# EAGLE design InCTF_Badge (EAGLE 9.4.2)
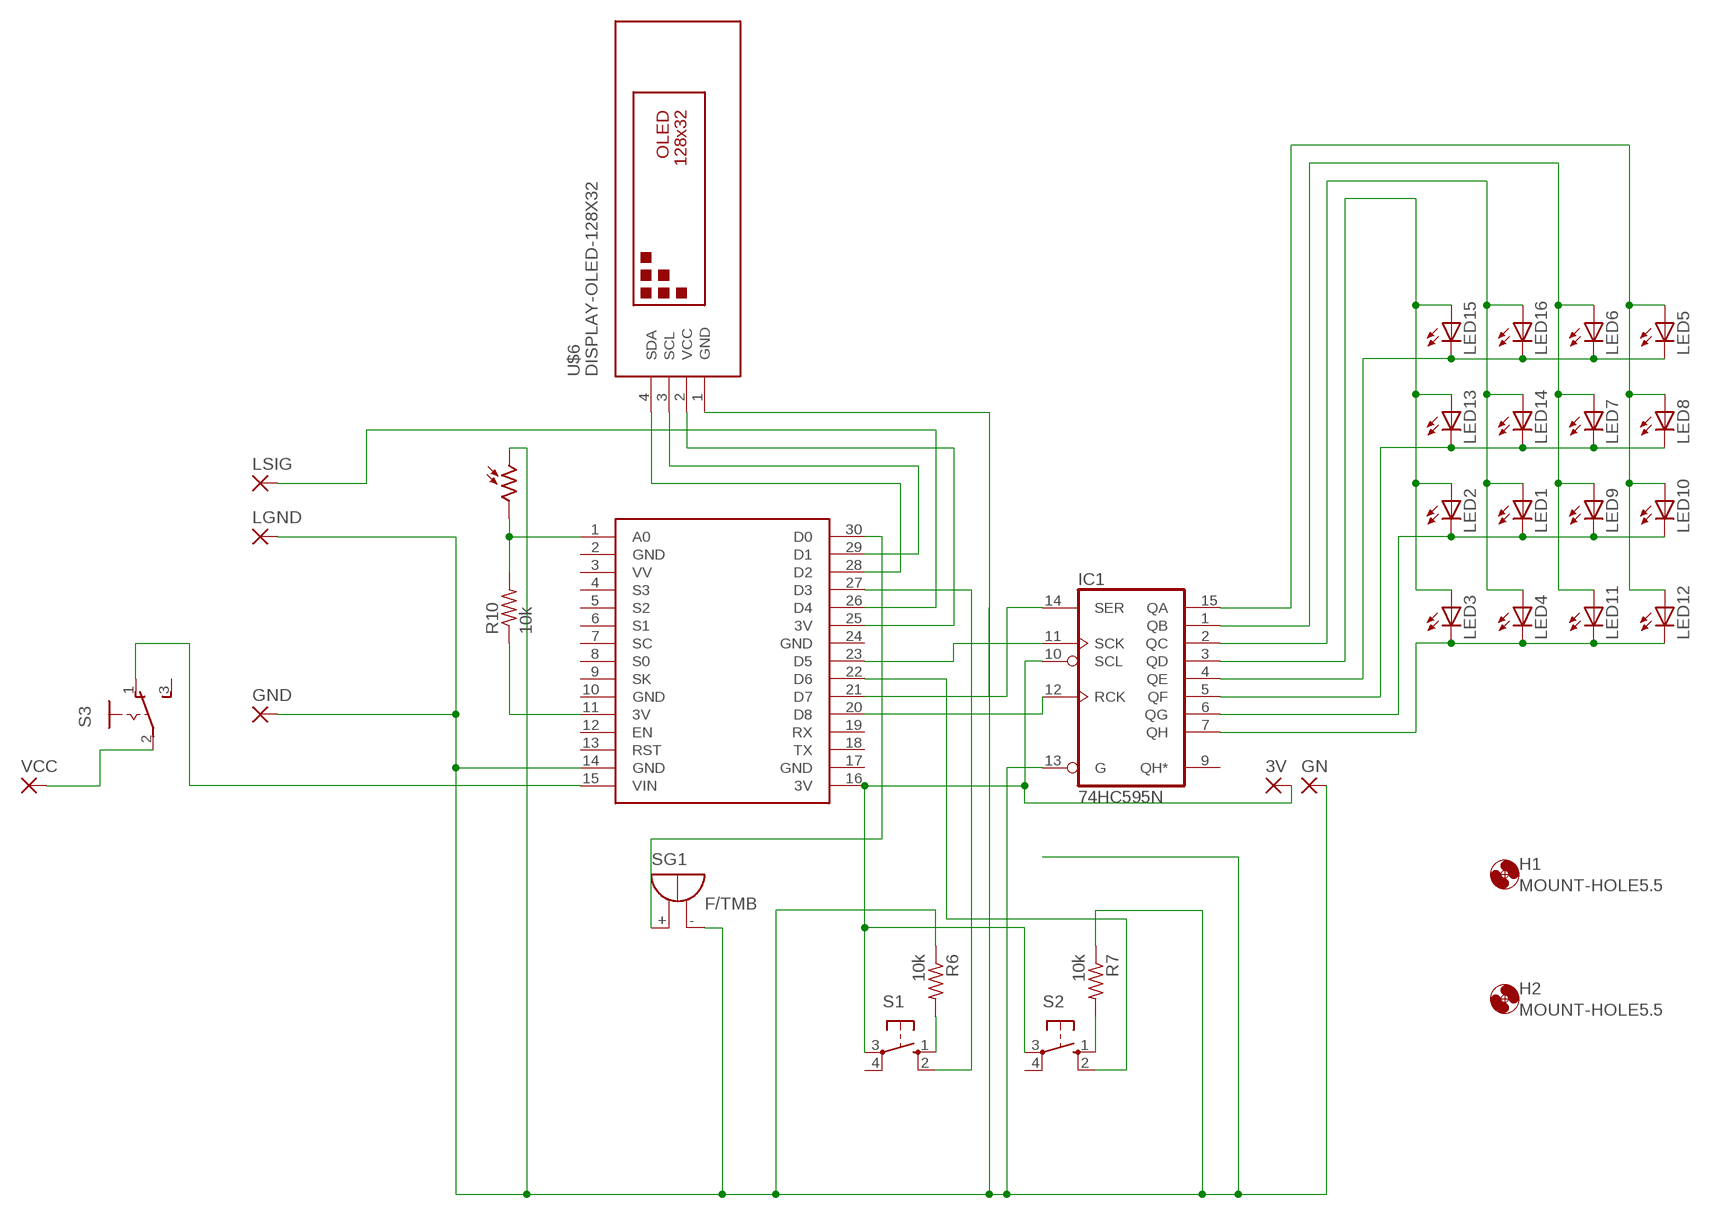
[diagram p0: schematic, sheet 1]

## Parts
3V  1,6/0,8  [1,6/0,8]
GN  1,6/0,8  [1,6/0,8]
GND  1,6/0,8  [1,6/0,8]
H1  MOUNT-HOLE5.5  [5,5]
H2  MOUNT-HOLE5.5  [5,5]
IC1  74HC595N  [DIL16]
LED1  LED5MM  [LED5MM]
LED2  LED5MM  [LED5MM]
LED3  LED5MM  [LED5MM]
LED4  LED5MM  [LED5MM]
LED5  LED5MM  [LED5MM]
LED6  LED5MM  [LED5MM]
LED7  LED5MM  [LED5MM]
LED8  LED5MM  [LED5MM]
LED9  LED5MM  [LED5MM]
LED10  LED5MM  [LED5MM]
LED11  LED5MM  [LED5MM]
LED12  LED5MM  [LED5MM]
LED13  LED5MM  [LED5MM]
LED14  LED5MM  [LED5MM]
LED15  LED5MM  [LED5MM]
LED16  LED5MM  [LED5MM]
LGND  1,6/0,8  [1,6/0,8]
LSIG  1,6/0,8  [1,6/0,8]
PH1  A1050_09  [T0-46-A10XX]
R6  10k  R-US_0204/5  [0204/5]
R7  10k  R-US_0204/5  [0204/5]
R10  10k  R-US_0204/5  [0204/5]
S1  10-XX  [B3F-10XX]
S2  10-XX  [B3F-10XX]
S3  255SB  [255SB]
SG1  F/TMB  [F/TMB]
U$1  NODEMCU  [NODEMCU]
U$6  DISPLAY-OLED-128X32  [DISPLAY-OLED-128X32]
VCC  1,6/0,8  [1,6/0,8]

## Nets
N$1: IC1.14(SER) U$1.21(D7)
N$2: U$1.29(D1) U$6.3(SCL)
N$3: U$1.28(D2) U$6.4(SDA)
N$4: U$1.25(3V) U$6.2(VCC)
N$6: IC1.12(RCK) U$1.20(D8)
N$7: IC1.11(SCK) U$1.23(D5)
N$8: S3.1(O) U$1.15(VIN)
N$9: S1.2(S1) U$1.27(D3)
N$10: LSIG.1(P) U$1.26(D4)
N$11: IC1.4(QE) LED5.K(C) LED6.K(C) LED15.K(C) LED16.K(C)
N$12: IC1.5(QF) LED7.K(C) LED8.K(C) LED13.K(C) LED14.K(C)
N$13: IC1.6(QG) LED1.K(C) LED2.K(C) LED9.K(C) LED10.K(C)
N$14: IC1.7(QH) LED3.K(C) LED4.K(C) LED11.K(C) LED12.K(C)
N$15: S3.2(P) VCC.1(P)
N$16: R10.1 U$1.11(3V)
N$17: SG1.+ U$1.30(D0)
N$19: IC1.3(QD) LED2.A LED3.A LED13.A LED15.A
N$20: IC1.2(QC) LED1.A LED4.A LED14.A LED16.A
N$21: IC1.1(QB) LED6.A LED7.A LED9.A LED11.A
N$22: IC1.15(QA) LED5.A LED8.A LED10.A LED12.A
N$23: 3V.1(P) IC1.10(SCL) S1.3(P) S2.3(P) U$1.16(3V)
N$25: R6.2 S1.1(S)
N$26: R7.2 S2.1(S)
N$31: PH1.2 R10.2 U$1.1(A0)
S2: S2.2(S1) U$1.22(D6)
V: GN.1(P) GND.1(P) IC1.13(G) LGND.1(P) PH1.1 R6.1 R7.1 SG1.- U$1.14(GND) U$6.1(GND)
Unconnected: IC1.9(QH*) S1.4(P1) S2.4(P1) S3.3(S) U$1.3(VV) U$1.4(S3) U$1.5(S2) U$1.6(S1) U$1.7(SC) U$1.8(S0) U$1.9(SK) U$1.12(EN) U$1.13(RST) U$1.18(TX) U$1.19(RX)

## Power pins joined to a net without a drawn wire
GND: U$1.10(GND) U$1.17(GND) U$1.24(GND)
N$34: IC1.8(GND) U$1.2(GND)
VCC: IC1.16(VCC)

## Library data of the parts
3V GN GND LGND LSIG VCC = wirepad:1,6/0,8: THROUGH-HOLE PAD
H1 H2 = holes:MOUNT-HOLE: MOUNTING HOLE with drill center marker
IC1 = 74xx-eu:74*595: 8-bit SHIFT REGISTER, output latch
LED1-LED16 = adafruit:LED: LED OSRAM: - CHIPLED LG R971, LG N971, LY N971, LG Q971, LY Q971, LO R971, LY R971 LH N974, LH R974 LS Q976, LO Q976, LY Q976 LO Q996 - Hyper CHIPLED LW Q18S LB Q993, LB Q99A, LB R99A - SideLED LS A670, LO A670, LY A670, LG A670, LP A670 LB A673, LV A673, LT A673, LW A673 LH A674 LY A675 LS A676, LA A676, LO A676, LY A676, LW A676 LS A679, LY A679, LG A679 - Hyper Micro SIDELED® LS Y876, LA Y876, LO Y876, LY Y876 LT Y87S - SmartLED LW L88C, LW L88S LB L89C, LB L89S, LG L890 LS L89K, LO L89K, LY L89K LS L896, LA L896, LO L896, LY L896 - TOPLED LS T670, LO T670, LY T670, LG T670, LP T670 LSG T670, LSP T670, LSY T670, LOP T670, LYG T670 LG T671, LOG T671, LSG T671 LB T673, LV T673, LT T673, LW T673 LH T674 LS T676, LA T676, LO T676, LY T676, LB T676, LH T676, LSB T676, LW T676 LB T67C, LV T67C, LT T67C, LS T67K, LO T67K, LY T67K, LW E67C LS E67B, LA E67B, LO E67B, LY E67B, LB E67C, LV E67C, LT E67C LW T67C LS T679, LY T679, LG T679 LS T770, LO T770, LY T770, LG T770, LP T770 LB T773, LV T773, LT T773, LW T773 LH T774 LS E675, LA E675, LY E675, LS T675 LS T776, LA T776, LO T776, LY T776, LB T776 LHGB T686 LT T68C, LB T68C - Hyper Mini TOPLED® LB M676 - Mini TOPLED Santana® LG M470 LS M47K, LO M47K, LY M47K Source: http://www.osram.convergy.de/
PH1 = ldr:A10: Sensor Robust Light Sensing Applications Outdoor Light Sensing Application Source: http://optoelectronics.perkinelmer.com/content/Datasheets/DTS_PhotocellsA1050.pdf
R6 R7 R10 = adafruit:R-US_: RESISTOR, American symbol
S1 S2 = switch-omron:10-XX: OMRON SWITCH; MPN: B3F-1000; OC_FARNELL: 176432; OC_NEWARK: 36M3542
S3 = switch:255SB: SLIDING SWITCH Distributor Buerklin, 11G810
SG1 = buzzer:F/TMB: BUZZER Source: Buerklin; OC_FARNELL: unknown; OC_NEWARK: unknown
U$1 = nodemcu:NODEMCU
U$6 = oled:DISPLAY-OLED-128X32: 128x32 Dot Matrix OLED Module with I2C interface based on SSD1306 chip More details available here: http://www.tinyosshop.com/index.php?route=product/product&product_id=953 Schematic available here: http://www.tinyosshop.com/datasheet/OLED%2012832.pdf SSD1306 datasheet: https://cdn-shop.adafruit.com/datasheets/SSD1306.pdf Click here to find device on ebay.com <http://www.ebay.com/sch/oled+display+128x32+i2c>

## Net classes
0 default: width 0.305 mm, drill 0.508 mm, clearance 0.254 mm

## Board
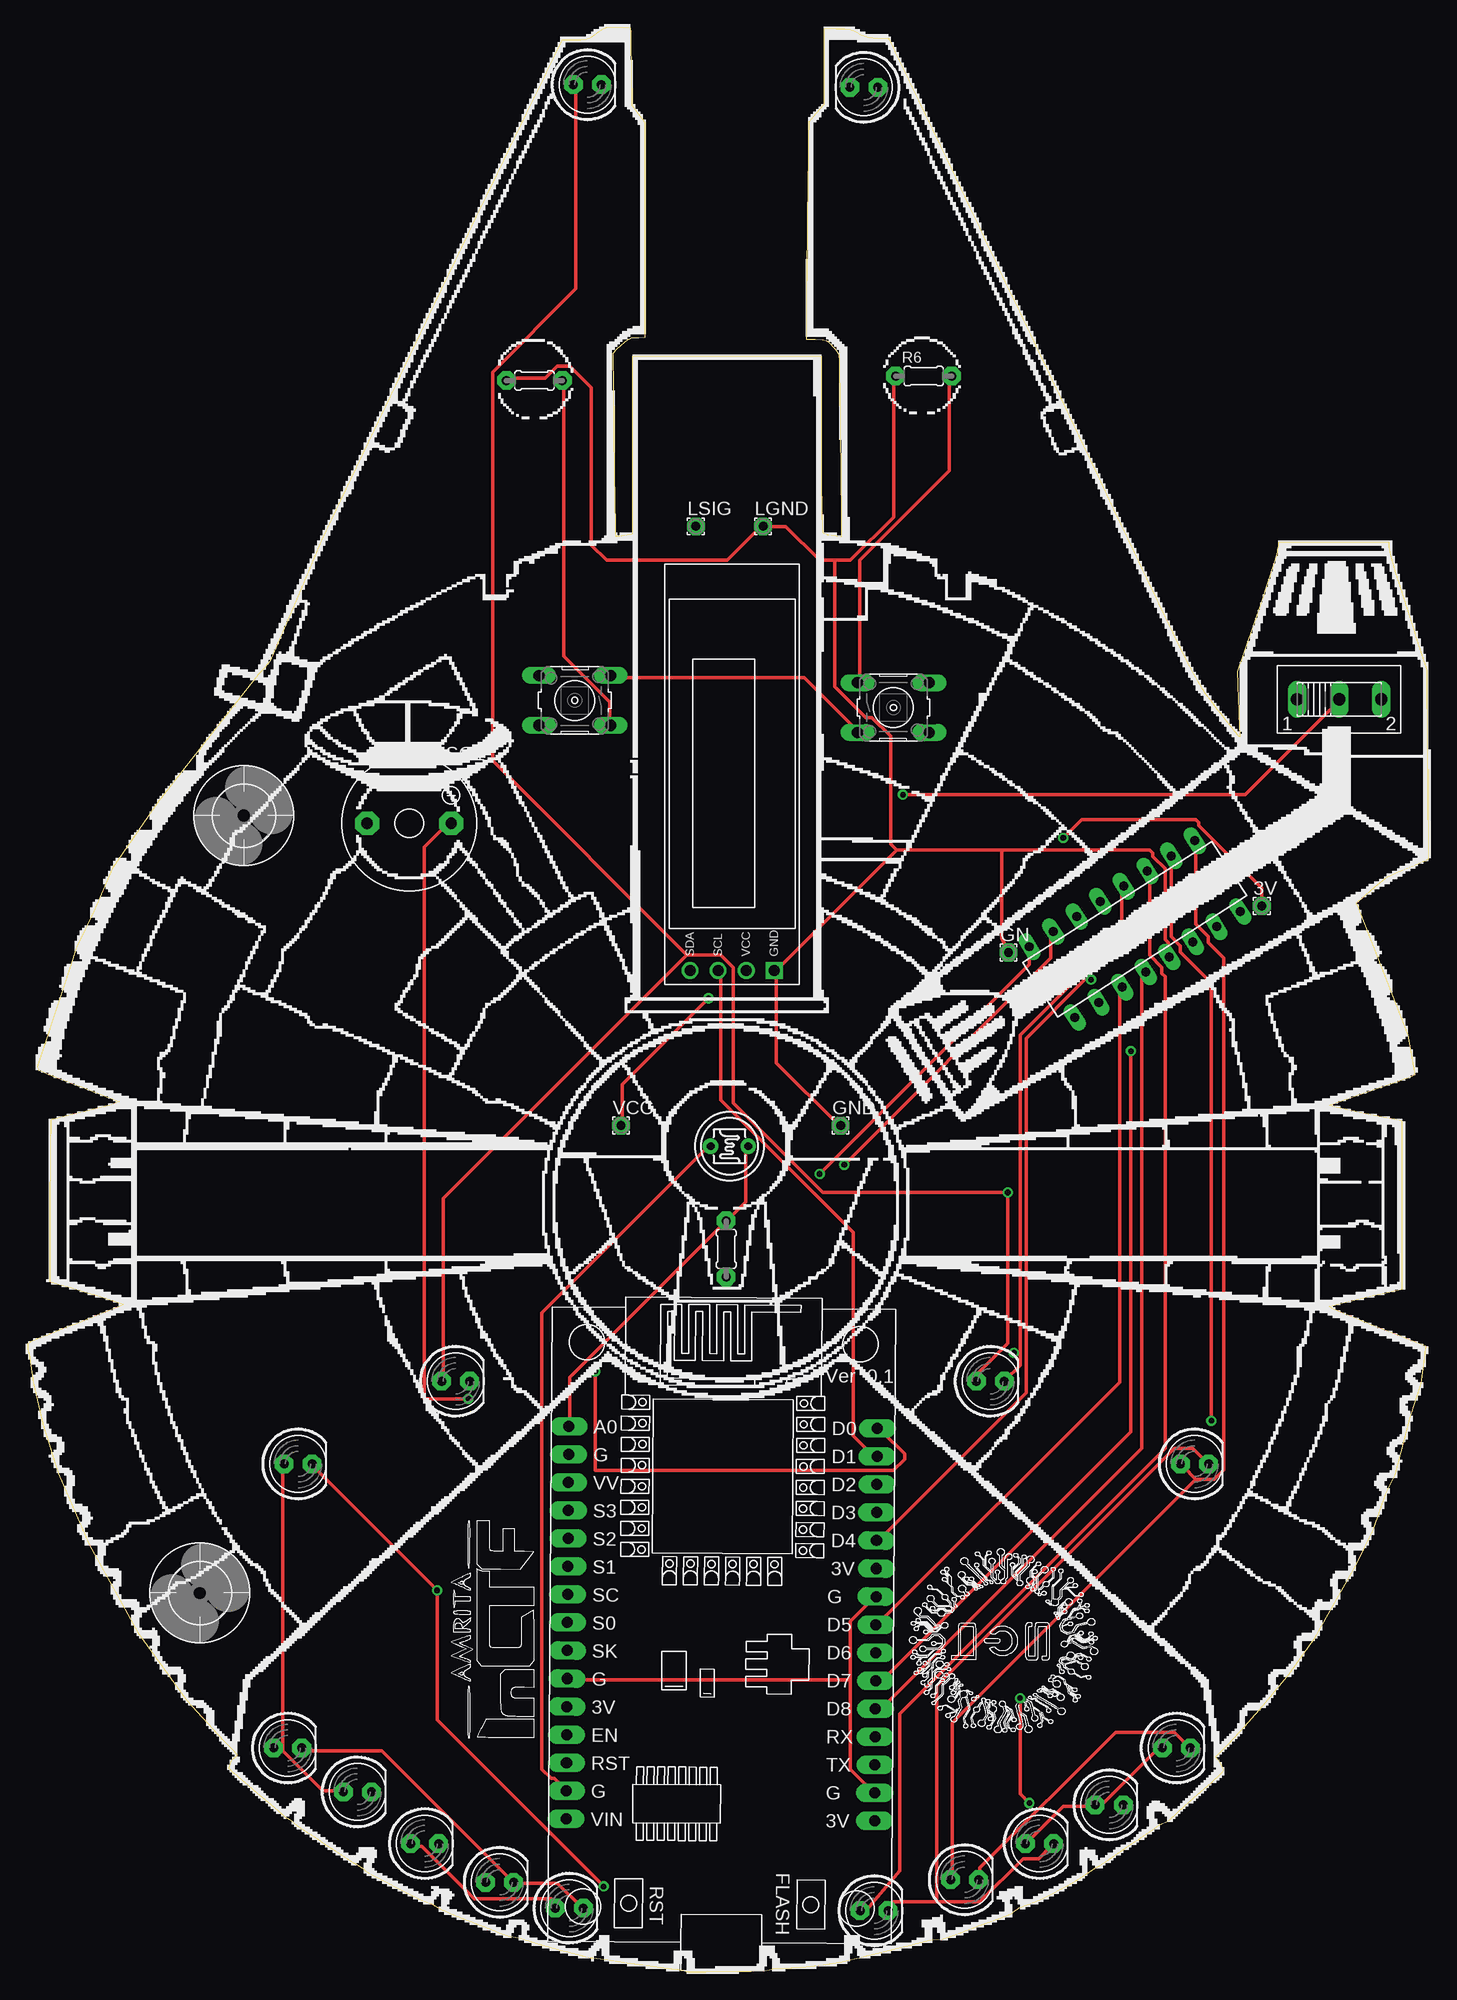
[diagram p1: board, top side]
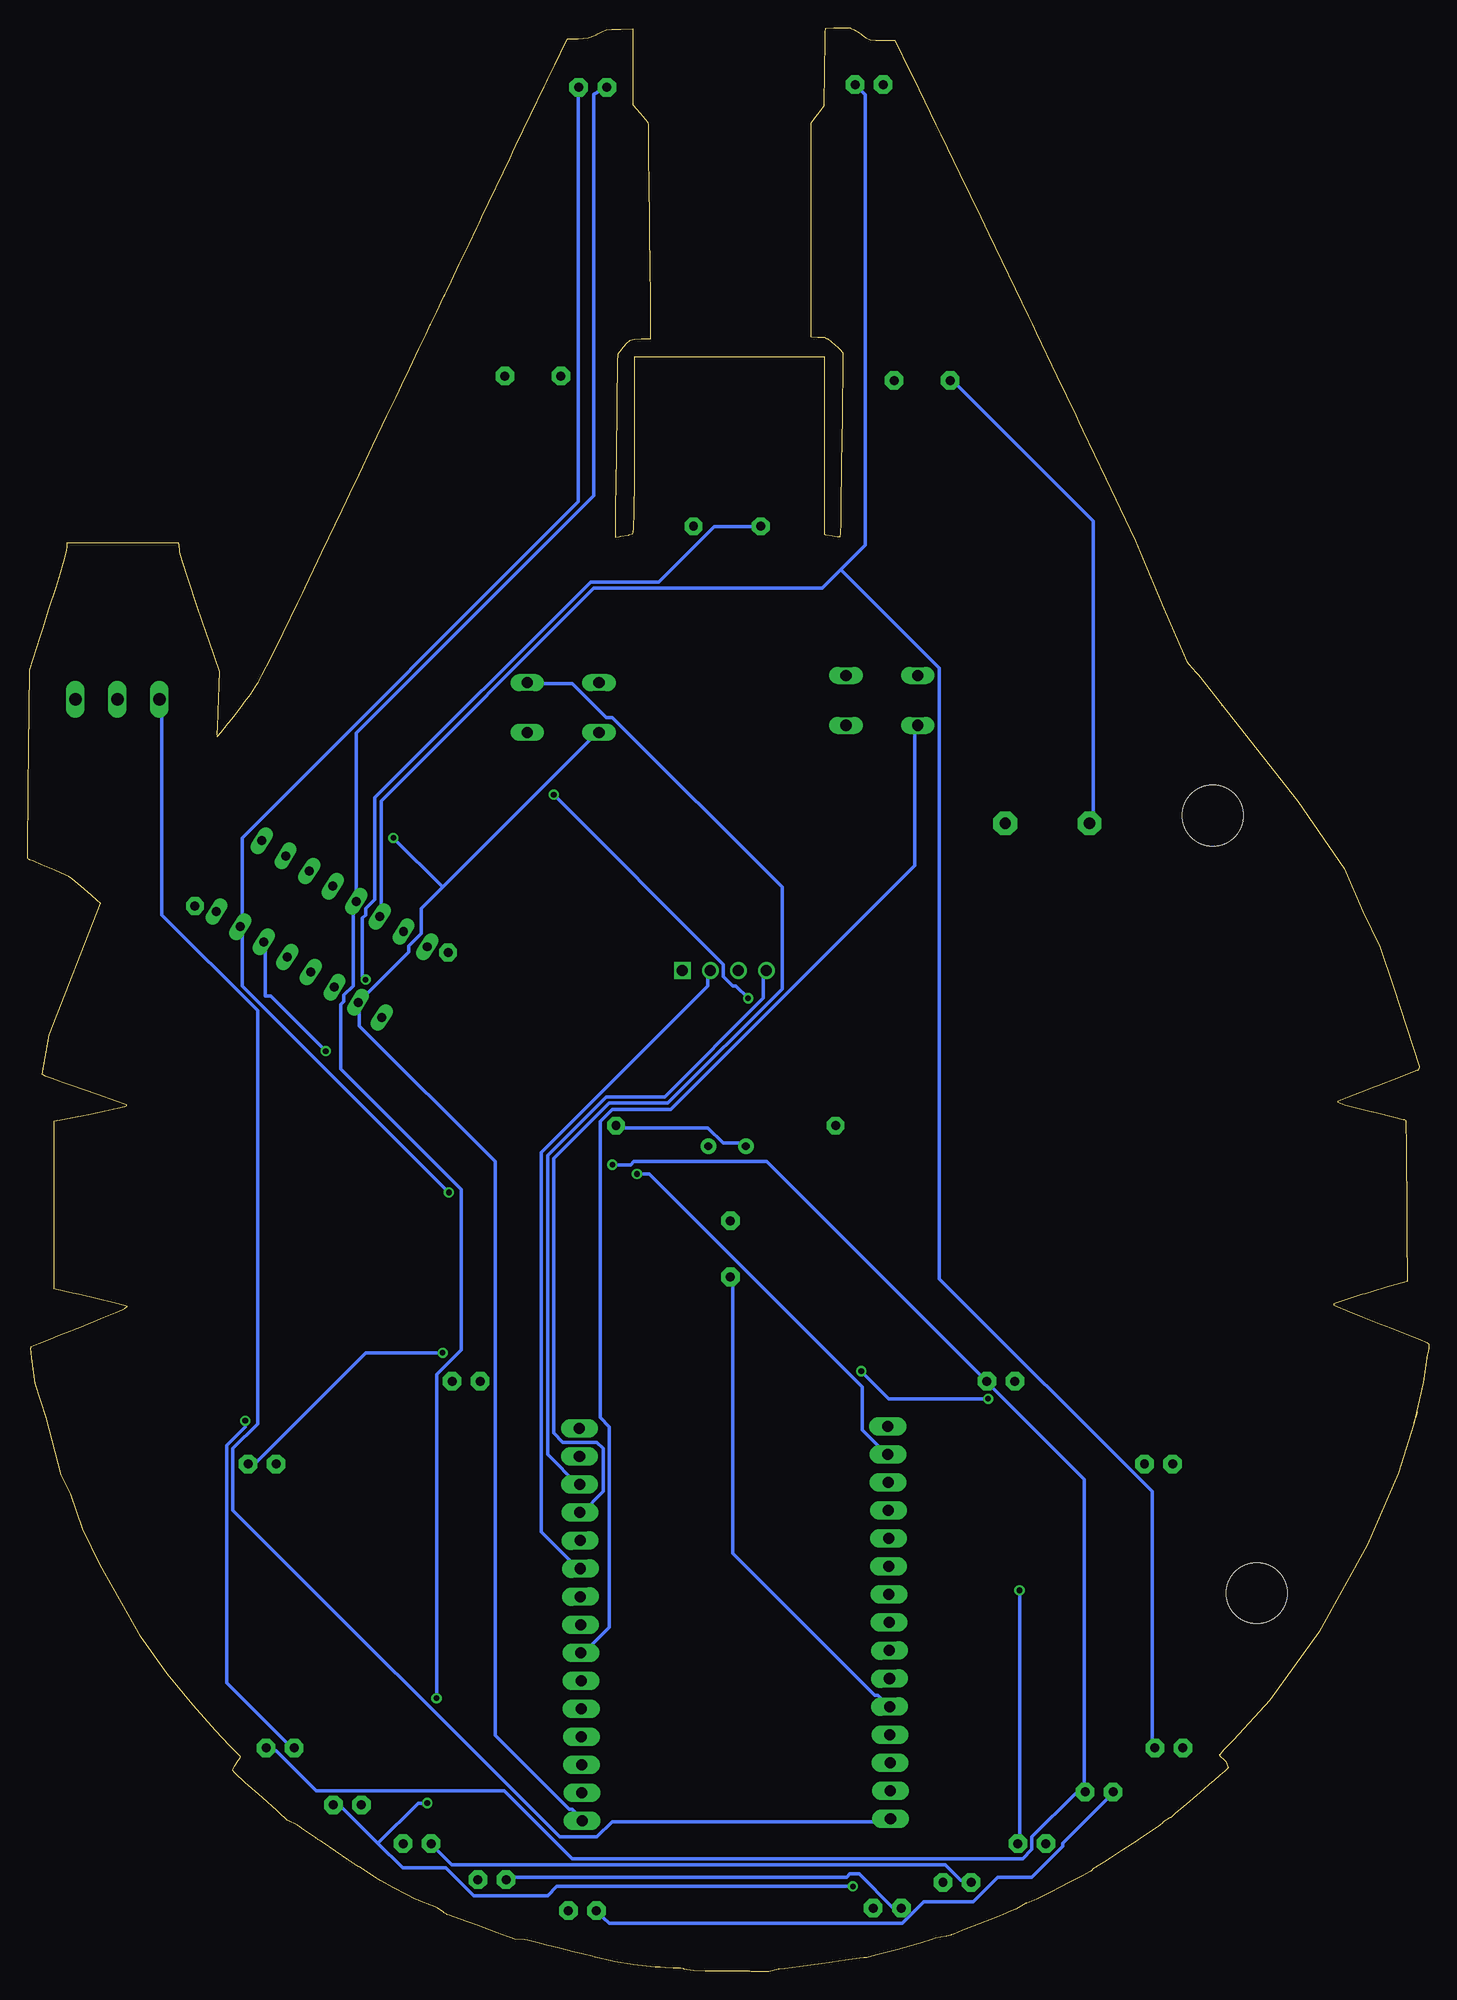
[diagram p2: board, bottom side, seen from below]

Size 126.93 x 176.15 mm. Coordinates in mm from the lower left corner, seen from the top.
Outline: 18.76,114.73 18.84,114.67
Outline: 1.08,50.74 1.08,50.73 1.17,50.44 1.34,49.9 1.37,49.78
Outline: 52.24,1.13 52.25,1.13 52.88,1.03 54.04,0.87 54.32,0.83 54.99,0.74 57.02,0.46 58.36,0.28 58.84,0.23 58.91,0.24 58.93,0.24 59.82,0 61.4,0.03 61.51,0.04 62.44,0.04 63.62,0.05 64.27,0.05 65.56,0.06 66.62,0.1 67.21,0.18 67.45,0.26 67.51,0.31 67.51,0.3 67.79,0.31 68.43,0.34 69.17,0.38 69.61,0.41 69.75,0.42 70.07,0.44 72.05,0.67 73.76,0.91 73.94,0.95 75.5,1.34 75.57,1.34 75.8,1.4 76.54,1.58 77.56,1.83 78.73,2.12 79.89,2.41 80.9,2.67 81.62,2.85 81.89,2.92 81.9,2.93 82.83,2.98 83.18,3.1 83.46,3.2 84.46,3.56 86.23,4.21 87.9,4.82 88.74,5.13 88.9,5.19 88.97,5.22 89.25,5.35 89.25,5.39 89.83,5.82 89.84,5.81 90.43,6.02 91.36,6.4 91.54,6.47 91.81,6.6 92.6,6.99 93.81,7.64 94.93,8.27 95.52,8.63 95.7,8.75 96.87,9.51 96.94,9.51 97.15,9.66 97.7,10.01 97.85,10.12 97.97,10.2 99.02,10.92 100.33,11.81 100.58,11.98 100.84,12.16 101.9,12.88 102.45,13.26 102.46,13.27 103.39,13.72 104.13,14.4 104.32,14.58 105.64,15.77 107.24,17.2 107.58,17.5 107.74,17.64 108.23,18.09 108.37,18.26 108.36,18.27 108.36,18.3 108.16,18.66 107.87,19.15 107.82,19.23 107.64,19.51 108.63,20.51 109.9,21.84 111.91,24.15 114.29,26.99 116.65,30.31 120.36,36.89 121.94,40.13 123.02,43.29 123.89,45.02 125.26,50.23 126.25,53.3 126.55,55.64 126.66,56.54 126.63,56.66 126.62,56.67 125.95,56.95 124.67,57.46 124.37,57.58 123.8,57.79 122.12,58.46 120.29,59.19 118.94,59.76 118.31,60.04 118.14,60.13 118.09,60.15 117.92,60.29 117.95,60.31 118.24,60.39 119.09,60.61 120.58,60.97 122.25,61.36 122.81,61.49 124.51,61.89 124.51,77.08 121.88,77.61 121.41,77.71 119.99,78 118.79,78.26 118.15,78.42 117.96,78.5 117.96,78.52 117.95,78.53 118.1,78.6 118.84,78.87 120.6,79.49 123,80.32 123.8,80.6 124.04,80.68 124.76,80.93 125.29,81.13 125.54,81.24 125.61,81.29 125.63,81.31 125,84.88 120.35,96.84 120.35,96.84 120.57,97.03 121.19,97.55 122.09,98.32 122.91,99.02 123.18,99.26 123.52,99.4 124.53,99.82 125.65,100.29 126.44,100.62 126.75,100.75 126.78,100.76 126.93,100.86 126.91,102.24 126.91,102.43 126.9,103.34 126.88,105.32 126.86,107.89 126.83,110.06 126.83,110.78 126.76,117.95 125.79,120.94 125.58,121.6 124.95,123.56 124.36,125.42 123.94,126.77 123.7,127.58 123.62,127.86 123.56,128.08 123.38,128.77 123.33,129.11 123.33,129.5 113.28,129.5 113.26,129.25 113.26,129.22 113.21,128.82 113.21,128.79 113.18,128.63 112.98,127.88 112.44,126.17 111.62,123.72 110.81,121.36 110.54,120.57 109.57,117.82 109.61,116.68 109.62,116.39 109.65,115.51 109.71,114.07 109.75,112.8 109.78,112.2 109.79,112.12 109.79,112.09 109.78,111.94 109.76,111.94 109.4,112.35 108.88,112.97 108.79,113.08 108.66,113.24 108.28,113.73 107.67,114.52 107.11,115.25 106.82,115.64 106.75,115.73 106.72,115.78 106.25,116.51 106.21,116.58 106.06,116.82 105.66,117.54 104.91,118.98 103.77,121.3 102.46,124.01 102.03,124.91 101.78,125.44 100.27,128.58 98.44,132.43 98.02,133.31 97.75,133.9 96.91,135.64 95.65,138.29 94.39,140.94 93.56,142.67 93.29,143.25 93.05,143.75 92.34,145.25 91.49,147.02 90.84,148.38 90.55,149.01 90.49,149.14 90.42,149.27 89.89,150.37 89.23,151.75 89.11,152.02 88.98,152.29 88.57,153.13 87.82,154.71 86.94,156.55 86.27,157.97 86.04,158.44 85.8,158.95 83.24,164.32 82.98,164.85 82.7,165.44 81.36,168.25 80.13,170.81 79.92,171.26 79.81,171.49 79.2,172.75 78.65,173.88 78.58,174.03 78.02,175.15 77.04,175.15 76.14,175.23 75.53,175.44 75.41,175.51 75.29,175.59 74.92,175.8 74.53,175.94 74.02,176 73.4,176.02 73.2,176.02 72.1,176.04 72.1,169.17 71.42,168.38 70.74,167.58 70.74,167.37 70.74,167.18 70.73,166.58 70.7,164.58 70.67,161.67 70.64,159.04 70.63,158.16 70.61,157.28 70.58,154.62 70.55,151.63 70.52,149.5 70.51,148.78 70.51,147.92 71.35,147.92 72,147.89 72.36,147.8 72.41,147.78 72.45,147.75 72.67,147.56 73.02,147.14 73.13,147.01 73.49,146.56 73.51,145.9 73.51,145.74 73.53,144.89 73.56,143.04 73.59,140.64 73.62,138.63 73.63,137.95 73.63,137.22 73.66,135.04 73.69,132.49 73.71,130.69 73.72,130.01 73.71,130 73.71,130 73.32,130.06 73.27,130.07 73.2,130.08 72.54,130.19 72.5,130.19 72.42,130.2 72.13,130.3 72.12,130.31 72.08,130.39 72.03,130.82 71.97,132.24 71.95,135.09 71.94,138.68 71.94,146.36 54.75,146.36 54.75,130.25 54.68,130.23 54.63,130.22 54.03,130.13 53.6,130.06 53.3,130.06 53.28,130.32 53.27,130.44 53.25,131.15 53.22,133.03 53.17,136.06 53.13,139.26 53.12,140.33 53.04,146.67 53.32,146.96 53.45,147.09 54.43,147.91 54.49,147.95 54.74,148.07 55.35,148.08 55.95,148.09 55.95,157.81 55.95,167.52 55.36,168.3 54.76,169.08 54.73,172.24 54.72,172.67 54.7,174.58 54.67,175.71 54.67,175.76 54.65,176.12 53.9,176.14 53.67,176.15 52.89,176.16 52.47,176.14 52.43,176.13 52.37,176.12 52.04,175.98 51.6,175.69 51.49,175.6 51.37,175.51 51,175.26 50.6,175.08 50.1,175.01 49.49,174.99 48.38,174.99 46.97,172.1 46.78,171.7 45.67,169.43 44.66,167.36 44.52,167.07 44.21,166.43 42.49,162.88 40.61,159 40.22,158.18 39.87,157.46 36.3,150.02 35.95,149.29 35.56,148.49 33.7,144.6 32.01,141.04 31.71,140.39 31.34,139.63 29.29,135.3 27.05,130.61 26.6,129.66 26.15,128.59 24,123.54 22.22,119.36 21.96,118.73 21.75,118.48 21.13,117.74 20.91,117.54 20.89,117.54 11.89,106.09 7.66,99.97 5.99,96.08 4.44,92.91 3.21,89.13 0.88,82.03 0.87,81.97 0.99,81.7 1.03,81.68 1.08,81.66 1.41,81.52 2.19,81.21 3.25,80.8 4.2,80.44 4.52,80.33 4.93,80.17 6.19,79.68 7.34,79.23 8.02,78.95 8.26,78.84 8.27,78.82 7.57,78.54 5.76,78.07 5.25,77.95 4.8,77.85 3.17,77.46 2.32,77.23 2.26,77.21 2.08,77.15 2.06,74.67 2.05,73.46 2.02,69.81 2,65.97 1.99,63.46 1.99,62.55 1.99,62.55 2,62.55 2.25,62.46 2.29,62.45 2.42,62.43 2.93,62.28 3.92,61.99 5.04,61.67 5.78,61.44 6.02,61.37 6.44,61.24 7.95,60.74 8.62,60.52 8.62,60.41 8.33,60.29 7.46,59.92 5.99,59.33 4.43,58.72 3.92,58.52 3.43,58.34 1.98,57.77 0.8,57.29 0.19,57.02 0.02,56.91 0.01,56.88 0,56.85 0.03,56.49 0.12,56.02 0.14,55.94 0.5,53.43 1.37,49.67 2.8,45.19 5.58,38.68 9.98,30.78 14.44,24.59 17.73,20.96 17.89,20.8 18.58,20.1 18.97,19.68 18.99,19.66 18.99,19.65 18.9,19.52 18.59,19.27 18.49,19.19 18.42,19.09 18.2,18.51 18.22,18.48 18.23,18.46 18.29,18.38 18.51,18.18 18.94,17.8 19.49,17.32 19.67,17.16 19.94,16.93 20.76,16.23 22,15.18 23.04,14.31 23.38,13.95 23.49,13.95 24.05,13.61 24.05,13.58 24.09,13.52 24.37,13.3 25.11,12.8 26.17,12.09 26.53,11.85 26.86,11.63 27.87,10.96 28.84,10.32 29.44,9.93 29.67,9.79 29.7,9.78 30.5,9.28 30.49,9.26 30.5,9.2 30.7,9.05 31.38,8.69 32.45,8.15 32.8,7.96 33.21,7.75 34.44,7.13 35.53,6.59 36.19,6.32 36.45,6.23 36.53,6.23 37.41,5.69 38,5.44 38.27,5.32 39.16,4.96 40.7,4.34 42.22,3.75 43.05,3.43 43.28,3.35 43.34,3.33 43.7,3.22 43.71,3.23 44.7,3.05 44.96,2.95 46.09,2.6 48.17,2 50.14,1.49 50.94,1.27 51.2,1.27 52.24,1.13
Copper layers (1*16): Top 0.035mm / dielectric 1.5mm / Bottom 0.035mm
Design rules "default *": minimum track width 10mil, minimum drill 0.35mm, track to track 6mil, track to pad 6mil, pad to pad 6mil, via to via 6mil, smd to smd 6mil, copper to edge 70mil, drill to drill 10mil, minimum pad ring 10mil, minimum via ring 8mil, stop-mask expansion 4mil, vias tented up to drill 0mil, thermal gap 10mil

### Footprints (pad centres in the part's own frame; a part is rotated, then mirrored left to right if it is on the bottom)
1,6/0,8 = drill 0.813 pad 1.6 octagon: 1 0,0
5,5 = hole 5.5: 0,0
DIL16 = drill 0.813 long: 1 -8.89,-3.81; 2 -6.35,-3.81; 3 -3.81,-3.81; 4 -1.27,-3.81; 5 1.27,-3.81; 6 3.81,-3.81; 7 6.35,-3.81; 8 8.89,-3.81; 9 8.89,3.81; 10 6.35,3.81; 11 3.81,3.81; 12 1.27,3.81; 13 -1.27,3.81; 14 -3.81,3.81; 15 -6.35,3.81; 16 -8.89,3.81
LED5MM = drill 0.813 pad 1.676 octagon: A -1.27,0; K 1.27,0
T0-46-A10XX = drill 0.7 pad 1.4: 1 -1.7,0; 2 1.7,0
0204/5 = drill 0.813 pad 1.676 octagon: 1 -2.54,0; 2 2.54,0
B3F-10XX = drill 1.016 long: 1 -3.251,2.261; 2 3.251,2.261; 3 -3.251,-2.261; 4 3.251,-2.261
255SB = drill 1.118 long: 1 -3.81,0; 2 0,0; 3 3.81,0
F/TMB = drill 1.016 pad 2.159 octagon: + 3.81,0; - -3.81,0
NODEMCU = drill 1 pad 1.676 long: 1 -13.97,17.78; 2 -13.97,15.24; 3 -13.97,12.7; 4 -13.97,10.16; 5 -13.97,7.62; 6 -13.97,5.08; 7 -13.97,2.54; 8 -13.97,0; 9 -13.97,-2.54; 10 -13.97,-5.08; 11 -13.97,-7.62; 12 -13.97,-10.16; 13 -13.97,-12.7; 14 -13.97,-15.24; 15 -13.97,-17.78; 16 13.97,-17.78; 17 13.97,-15.24; 18 13.97,-12.7; 19 13.97,-10.16; 20 13.97,-7.62; 21 13.97,-5.08; 22 13.97,-2.54; 23 13.97,0; 24 13.97,2.54; 25 13.97,5.08; 26 13.97,7.62; 27 13.97,10.16; 28 13.97,12.7; 29 13.97,15.24; 30 13.97,17.78
DISPLAY-OLED-128X32 = drill 1 square: 1 -17.78,-3.81 | drill 1: 2 -17.78,-1.27; 3 -17.78,1.27; 4 -17.78,3.81

### Placement (x,y rotation side)
3V  111.78,96.57 0 top
GN  88.85,92.36 0 top
GND  73.64,76.68 0 top
H1  15.61,34.33 0 top
H2  19.58,104.76 0 top
IC1  100.29,94.48 212.7 top
LED1  42.75,8.12 0 top
LED2  23.56,20.29 0 top
LED3  29.88,16.31 0 top
LED4  104.06,20.29 0 top
LED5  87.21,53.51 0 top
LED6  105.7,46.03 0 top
LED7  35.96,11.63 0 top
LED8  75.74,170.75 180 top
LED9  49.07,5.78 0 top
LED10  50.71,170.98 0 top
LED11  84.87,8.35 0 top
LED12  38.77,53.51 0 top
LED13  24.5,46.03 0 top
LED14  97.97,15.14 0 top
LED15  76.68,5.54 0 top
LED16  91.66,11.63 0 top
LGND  66.62,130.97 0 top
LSIG  60.53,130.97 0 top
PH1  63.58,74.81 0 top
R6  81.17,144.58 0 top
R7  45.91,144.19 0 top
R10  63.28,65.5 90 top
S1  78.43,114.55 0 top
S2  49.56,115.2 180 top
S3  118.8,115.29 0 top
SG1  34.56,104.06 0 top
U$1  62.87,31.56 359.6 top
U$6  63.82,108.51 90 top
VCC  53.75,76.68 0 top

### Tracks (layer width: path | path; a pad name or v marks a point on that pad's centre or on a via)
GND
  Top 0.305: 74.53,26.47 74.53,31.78 76.76,34.01 U$1.24 | 74.53,26.47 74.53,18.37 76.48,16.41 U$1.17 | 74.53,26.47 49.1,26.47 U$1.10
N$1  (via drill 0.51)
  Top 0.305: v99.93,83.43 99.93,48.93 76.93,25.93 U$1.21
  Bottom 0.305: v99.93,83.43 104.93,88.43 105.43,88.43 105.43,92.93 IC1.14
N$2
  Top 0.305: U$6.3 62.79,90.45 62.79,79 74.81,66.98 74.81,48.54 76.76,46.59 U$1.29
N$3
  Bottom 0.305: U$6.4 60.28,90.45 60.28,88.22 69.22,79.28 74.53,79.28 79.84,73.97 79.84,46.87 77.04,44.07 U$1.28
N$4
  Bottom 0.305: U$6.2 65.31,90.45 65.31,89.34 80.39,74.25 80.39,39.88 77.04,36.53 U$1.25
N$6
  Top 0.305: IC1.12 100.93,90.43 100.93,47.43 76.93,23.43 U$1.20
N$7
  Top 0.305: IC1.11 98.93,88.93 98.93,53.43 76.93,31.43 U$1.23
N$8
  Bottom 0.305: U$1.15 48.82,13.62 73.97,13.62 75.37,12.22 78.72,12.22 108.33,41.84 108.33,47.43 106.1,49.66 106.1,87.1 114.76,95.76 114.76,115.04 S3.1
N$9
  Bottom 0.305: S1.2 81.51,116.72 77.6,116.72 74.53,113.64 73.97,113.64 58.6,98.28 58.6,89.06 68.94,78.72 74.25,78.72 79.28,73.69 79.28,48.82 78.44,47.98 75.37,47.98 74.81,47.43 74.81,43.51 76.76,41.56 U$1.27
N$10  (via drill 0.51)
  Top 0.305: v96.32,89.89 95.76,89.89 90.45,84.59 90.45,52.45 77.04,39.04 U$1.26
  Bottom 0.305: v96.32,89.89 96.6,90.17 96.6,95.48 96.32,95.76 96.32,96.32 95.48,97.16 95.48,106.38 75.92,125.94 69.78,125.94 64.75,130.97 60.56,130.97 LSIG.1
N$11  (via drill 0.51)
  Top 0.305: 82.35,6.35 86.26,6.35 90.17,10.27 91.57,10.27 92.69,11.38 LED16.K | 82.35,6.35 78.45,6.35 LED15.K | 89.89,56.09 89.89,54.97 88.5,53.57 LED5.K | 89.89,56.09 89.89,84.87 99.11,94.09 99.11,98.28 IC1.4 | 89.89,56.09 v89.34,56.09 | 82.35,6.35 82.35,25.91 103.86,47.43 105.54,47.43 106.94,46.03 LED6.K
  Bottom 0.305: v89.34,56.09 96.32,56.09 106.38,46.03 106.94,46.03 LED6.K
N$12  (via drill 0.51)
  Top 0.305: LED13.K 25.91,45.75 v37.09,34.57 37.09,22.84 v52.18,7.75 | v89.89,24.79 89.89,16.13 v90.73,15.29
  Bottom 0.305: LED8.K 75.64,170.12 75.64,133.76 97.16,112.25 97.16,97.16 IC1.5 97.44,96.88 97.44,89.34 98.28,88.5 98.28,87.94 98.56,87.66 98.56,81.79 87.66,70.9 87.66,56.37 89.89,54.13 v89.89,24.79 | v37.09,34.57 37.09,11.66 LED7.K | 95.2,11.66 92.97,9.43 89.06,9.43 86.54,6.91 79.84,6.91 79,7.75 v52.18,7.75 | 95.2,11.66 98.56,15.02 99.11,15.02 LED14.K | v90.73,15.29 91.57,15.29 95.2,11.66
N$13
  Top 0.305: LED9.K 50.31,5.79 50.22,5.79 47.98,8.03 44.07,8.03 LED1.K 43.79,8.31 32.06,20.04 25.07,20.04 LED2.K
  Bottom 0.305: 53.29,127.05 51.06,129.29 51.06,170.08 51.71,170.73 LED10.K | 53.29,127.05 54.97,125.38 75.64,125.38 94.92,106.1 94.92,95.76 IC1.6 | 53.29,127.05 44.35,118.11 44.35,62.79 25.07,43.51 25.07,20.32 LED2.K
N$14  (via drill 0.51)
  Top 0.305: LED11.K 86.26,8.59 86.26,9.43 98.56,21.72 103.86,21.72 105.26,20.32 LED4.K | v73.97,73.13 92.69,91.85 92.69,94.09 IC1.7
  Bottom 0.305: v73.97,73.13 72.29,73.13 72.01,73.41 60,73.41 40.16,53.57 LED12.K 39.88,53.29 31.22,44.63 31.22,16.41 LED3.K 31.22,16.13 32.06,16.13 35.97,12.22 35.97,11.1 36.81,10.27 77.6,10.27 83.75,16.41 100.79,16.41 104.42,20.04 105.26,20.04 LED4.K
N$15  (via drill 0.51)
  Top 0.305: v61.67,88.22 53.85,80.39 53.85,76.76 VCC.1 | v79.28,106.66 110.29,106.66 118.67,115.04 S3.2
  Bottom 0.305: v61.67,88.22 62.79,89.34 63.07,89.34 63.91,90.17 63.91,91.29 v79.28,106.66
N$16
  Bottom 0.305: U$1.11 49.1,24.24 49.94,25.07 50.22,25.07 63.07,37.93 63.07,62.79 R10.1
N$17  (via drill 0.51)
  Top 0.305: v51.43,54.43 51.43,45.43 78.43,45.43 79.43,46.43 79.43,46.93 77.43,48.93 U$1.30 | v39.93,51.93 35.93,51.93 35.93,101.93 37.93,103.93 SG1.+
  Bottom 0.305: v51.43,54.43 48.93,51.93 v39.93,51.93
N$19
  Top 0.305: 23.12,20.04 22.56,20.04 LED2.A 23.12,20.04 | 23.12,20.04 26.75,16.41 28.43,16.41 LED3.A | 23.12,20.04 23.12,45.75 LED13.A | IC1.3 101.63,99.67 101.63,92.13 102.75,91.01 102.75,90.45 103.03,90.17 103.03,47.43 79,23.4 79,9.15 76.01,5.64 LED15.A
  Bottom 0.305: LED3.A 28.71,16.13 33.18,11.66 33.18,11.38 35.97,8.59 39.04,8.59 41.28,6.35 45.75,6.35 47.7,4.4 74.25,4.4 75.4,5.45 LED15.A
N$20  (via drill 0.51)
  Top 0.305: LED16.A 90.45,11.66 93.81,15.02 96.6,15.02 LED14.A 96.88,15.29 97.44,15.29 102.19,20.04 102.75,20.04 LED4.A | v107.22,49.94 107.22,89.61 104.42,92.41 104.42,92.97 103.58,93.81 103.58,101.07 IC1.2
  Bottom 0.305: LED1.A 41.56,8.31 42.4,8.31 43.79,9.71 88.5,9.71 90.17,11.38 LED16.A | v107.22,49.94 107.22,49.38 108.89,47.7 108.89,26.19 103.03,20.32 LED4.A
N$21
  Top 0.305: LED7.A 34.85,11.38 35.69,11.38 40.44,6.63 47.43,6.63 47.74,6.32 LED9.A | 105.82,44.63 107.5,44.63 108.33,45.47 108.33,91.85 106.94,93.25 106.94,93.81 105.82,94.92 105.82,102.47 IC1.1 | 105.82,44.63 104.7,45.75 LED6.A | 105.82,44.63 83.75,22.56 83.75,8.59 LED11.A
  Bottom 0.305: LED11.A 83.47,8.59 52.73,8.59 52.45,8.87 51.62,8.87 48.57,5.83 LED9.A
N$22  (via drill 0.51)
  Top 0.305: LED5.A 85.98,53.57 85.98,54.13 88.78,56.93 v88.78,70.62 72.01,70.62 63.91,78.72 63.91,91.01 62.79,92.13 59.72,92.13 | 59.72,92.13 37.65,70.06 37.65,53.57 LED12.A | 59.72,92.13 42.12,109.73 42.12,144.94 49.66,152.48 49.66,170.75 LED10.A
  Bottom 0.305: v88.78,70.62 107.5,89.34 107.5,94.64 IC1.15 107.5,94.92 107.5,102.75 77.04,133.2 77.04,170.75 LED8.A
N$23  (via drill 0.51)
  Top 0.305: S2.3 53.01,117.28 70.34,117.28 75.09,112.53 S1.3 | v93.81,102.75 95.48,104.42 105.82,104.42 106.1,104.14 106.1,103.86 111.78,98.18 3V.1
  Bottom 0.305: 89.34,98.28 75.37,112.25 S1.3 | 89.34,98.28 91.29,96.32 91.29,94.09 92.41,92.97 92.41,92.41 96.88,87.94 96.93,87.93 IC1.10 96.93,87.43 96.88,87.43 | 96.88,87.66 96.88,87.43 | 96.88,87.43 96.88,85.7 84.59,73.41 84.59,21.44 77.88,14.74 77.6,14.74 76.76,13.9 U$1.16 | 89.34,98.28 v93.81,102.75
N$25
  Top 0.305: S1.1 75.37,117 75.37,127.89 83.47,136 83.47,144.38 R6.2
N$26
  Top 0.305: S2.1 52.73,113.08 52.73,115.04 48.54,119.23 48.54,144.1 R7.2
N$31
  Top 0.305: PH1.2 65.03,74.75 65.03,69.78 63.35,68.1 R10.2 63.07,67.82 49.1,53.85 49.1,49.66 U$1.1
N$34  (via drill 0.51)
  Top 0.305: v71.73,72.29 90.73,91.29 90.73,92.69 IC1.8
  Bottom 0.305: v71.73,72.29 70.62,72.29 51.34,53.01 51.34,49.1 49.1,46.87 U$1.2
S2
  Bottom 0.305: S2.2 46.59,112.81 46.59,100.23 68.66,78.16 73.97,78.16 75.09,77.04 75.09,50.22 74.25,49.38 74.25,31.22 76.76,28.71 U$1.22
V
  Top 0.305: 73.13,127.89 74.53,127.89 78.44,131.8 78.44,144.38 R6.1 | 73.13,127.89 71.73,127.89 68.66,130.97 66.7,130.97 LGND.1 66.42,130.97 63.35,127.89 52.45,127.89 51.06,129.29 51.06,143.54 49.1,145.49 47.98,145.49 46.87,144.38 43.51,144.38 R7.1 | 103.31,92.43 103.31,93.25 103.03,93.53 103.03,99.95 101.91,101.07 101.91,101.35 101.63,101.63 88.22,101.63 | 103.31,92.43 103.31,92.13 | 78.72,101.63 88.22,101.63 | 78.72,101.63 67.82,90.73 U$6.1 67.82,90.45 67.82,82.35 73.41,76.76 GND.1 | U$1.14 48.54,16.69 47.7,17.53 47.43,17.53 46.59,18.37 46.59,59.72 61.6,74.73 PH1.1 | 73.13,127.89 73.13,116.44 75.92,113.64 76.48,113.64 78.16,111.97 78.16,102.19 78.72,101.63 | 88.22,101.63 88.22,93.65 GN.1 | IC1.13 103.43,92.43 103.31,92.43
  Bottom 0.305: PH1.1 61.99,75.09 63.91,75.09 65.31,76.48 73.41,76.48 GND.1 | R7.1 42.93,143.93 30.43,131.43 30.43,104.43 SG1.-